# EAGLE schematic spartan6lx_board (EAGLE 5.11)
PROJECT: SPARTAN6-LX9 DEV BOARD
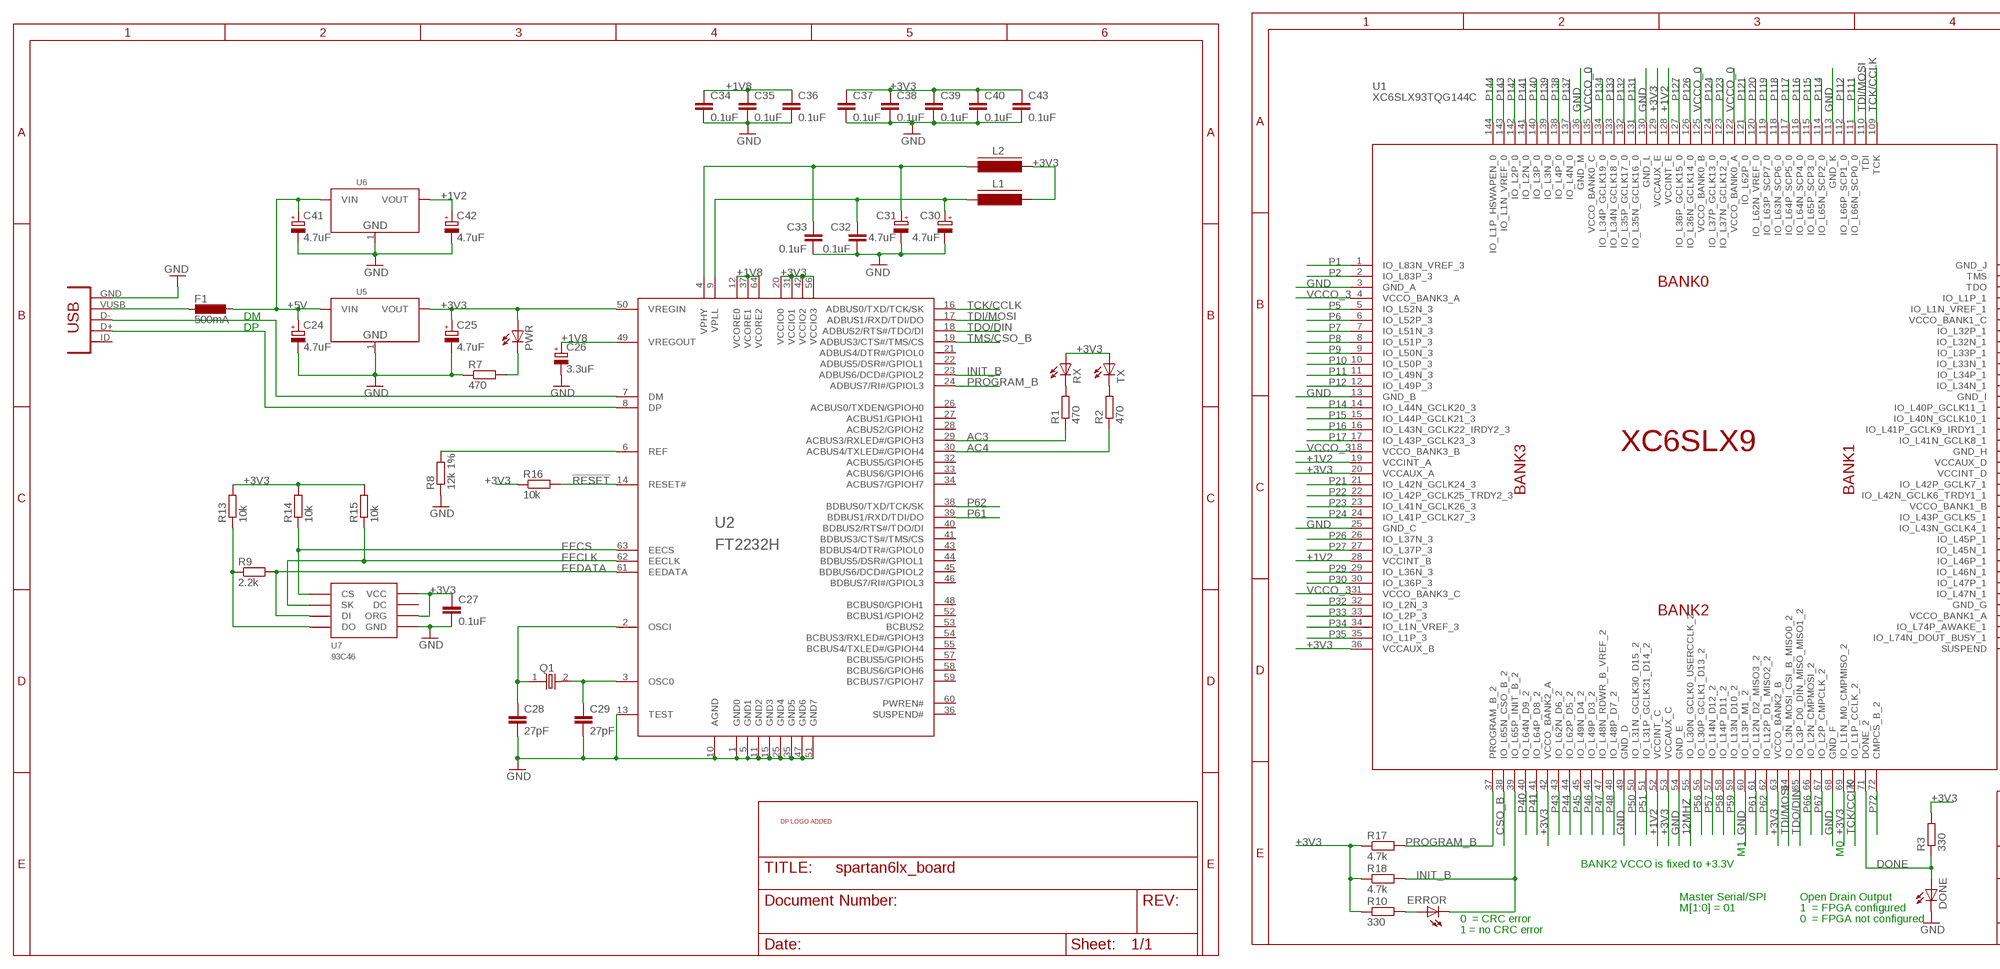
[diagram p0: schematic, sheet 1, part 1 of 2]
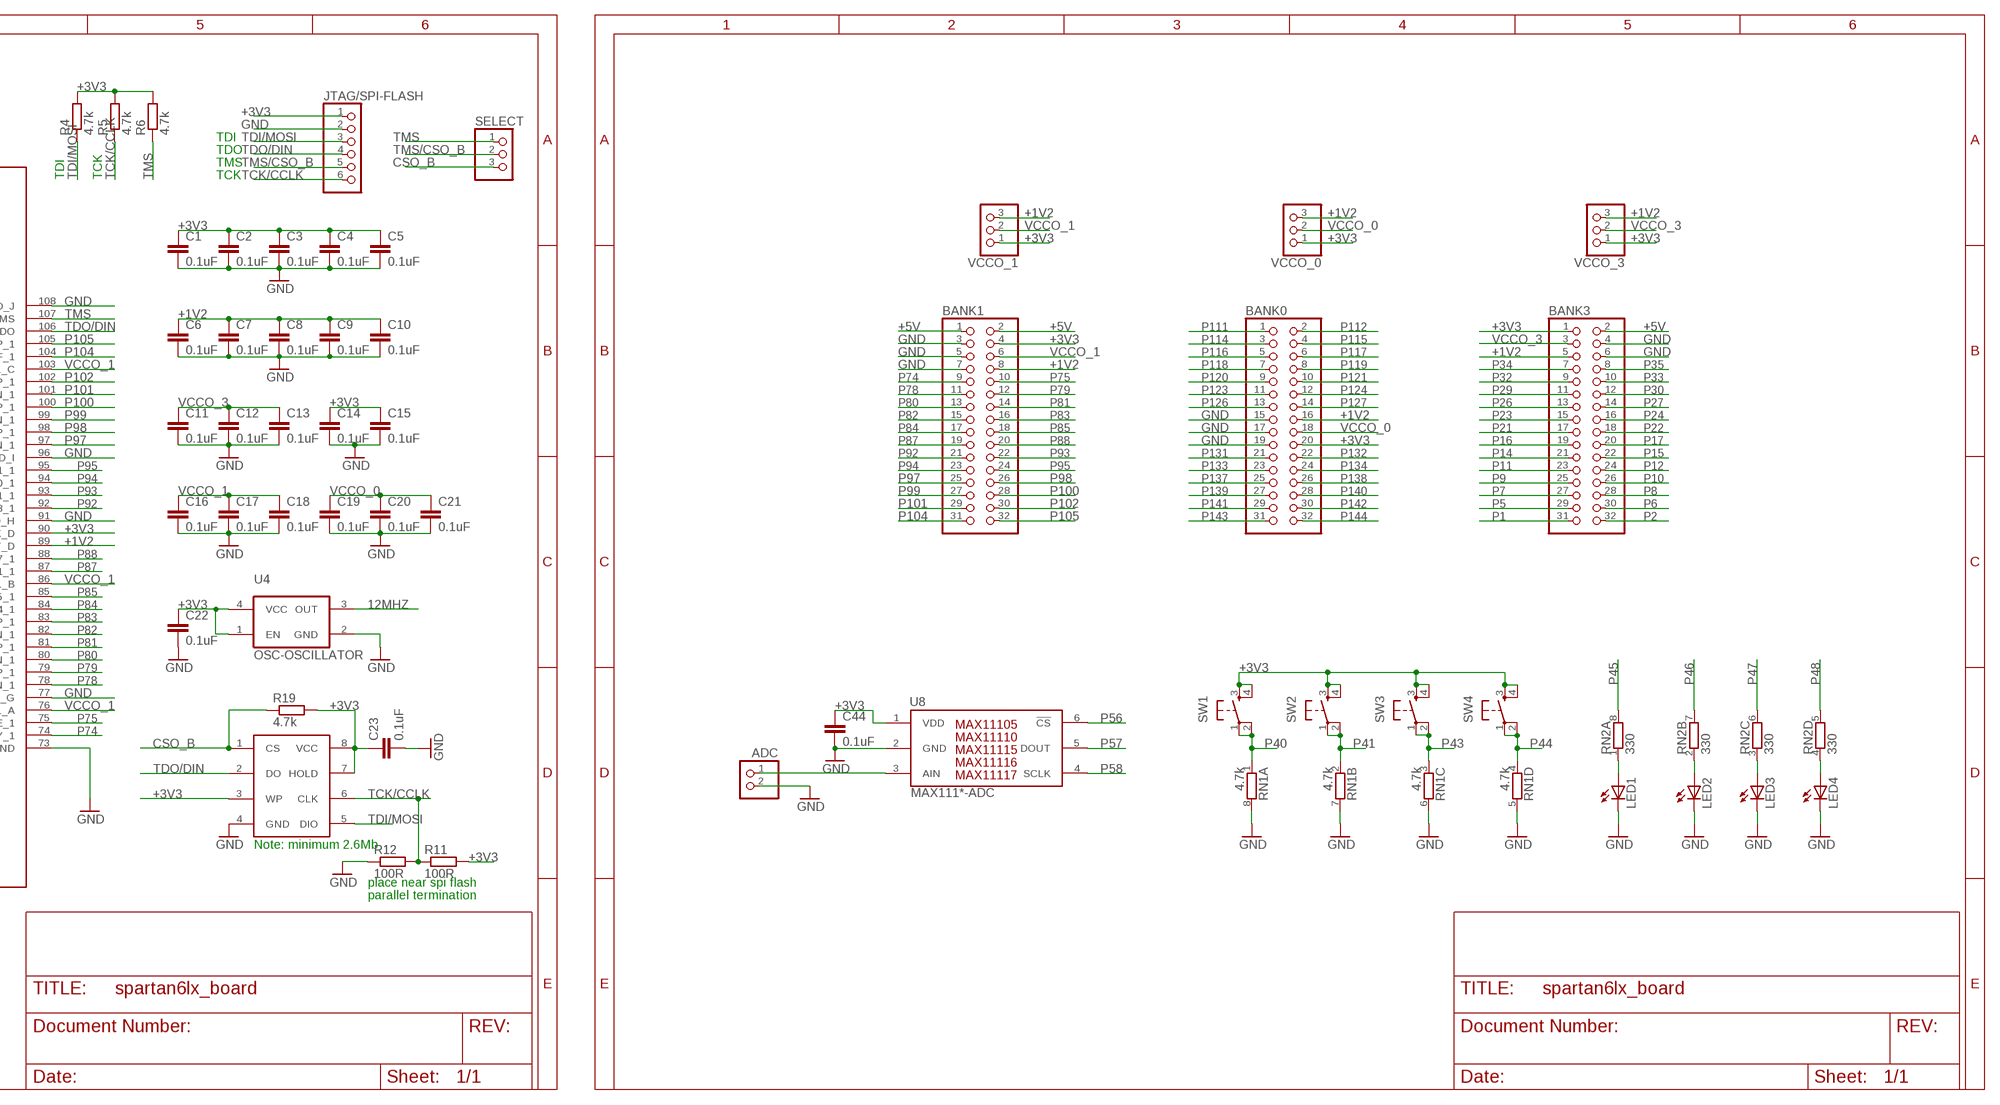
[diagram p1: schematic, sheet 1, part 2 of 2]

## Parts
ADC  PINHD-1X2  [1X02]
BANK0  PINHD-2X16  [2X16]
BANK1  PINHD-2X16  [2X16]
BANK3  PINHD-2X16  [2X16]
C1  0.1uF  CAPC603  [C603]
C2  0.1uF  CAPC603  [C603]
C3  0.1uF  CAPC603  [C603]
C4  0.1uF  CAPC603  [C603]
C5  0.1uF  CAPC603  [C603]
C6  0.1uF  CAPC603  [C603]
C7  0.1uF  CAPC603  [C603]
C8  0.1uF  CAPC603  [C603]
C9  0.1uF  CAPC603  [C603]
C10  0.1uF  CAPC603  [C603]
C11  0.1uF  CAPC603  [C603]
C12  0.1uF  CAPC603  [C603]
C13  0.1uF  CAPC603  [C603]
C14  0.1uF  CAPC603  [C603]
C15  0.1uF  CAPC603  [C603]
C16  0.1uF  CAPC603  [C603]
C17  0.1uF  CAPC603  [C603]
C18  0.1uF  CAPC603  [C603]
C19  0.1uF  CAPC603  [C603]
C20  0.1uF  CAPC603  [C603]
C21  0.1uF  CAPC603  [C603]
C22  0.1uF  CAPC603  [C603]
C23  0.1uF  CAPC603  [C603]
C24  4.7uF  CAP_POLSMC_A  [SMC_A]
C25  4.7uF  CAP_POLSMC_A  [SMC_A]
C26  3.3uF  CAP_POLSMC_A  [SMC_A]
C27  0.1uF  CAPC603  [C603]
C28  27pF  CAPC603  [C603]
C29  27pF  CAPC603  [C603]
C30  4.7uF  CAP_POLSMC_A  [SMC_A]
C31  4.7uF  CAP_POLSMC_A  [SMC_A]
C32  0.1uF  CAPC603  [C603]
C33  0.1uF  CAPC603  [C603]
C34  0.1uF  CAPC603  [C603]
C35  0.1uF  CAPC603  [C603]
C36  0.1uF  CAPC603  [C603]
C37  0.1uF  CAPC603  [C603]
C38  0.1uF  CAPC603  [C603]
C39  0.1uF  CAPC603  [C603]
C40  0.1uF  CAPC603  [C603]
C41  4.7uF  CAP_POLSMC_A  [SMC_A]
C42  4.7uF  CAP_POLSMC_A  [SMC_A]
C43  0.1uF  CAPC603  [C603]
C44  0.1uF  CAPC603  [C603]
DONE  LED805  [LED-805]
ERROR  LED805  [LED-805]
F1  500mA  L-EUL1812  [L1812]
JTAG/SPI-FLASH  PINHD-1X6  [1X06]
L1  FERRITE_BEAD805  [FB805]
L2  FERRITE_BEAD805  [FB805]
LED1  LED805  [LED-805]
LED2  LED805  [LED-805]
LED3  LED805  [LED-805]
LED4  LED805  [LED-805]
PWR  LED805  [LED-805]
Q1  OSC-XTAL  [HC-49U]
R1  470  RESISTORR603  [R603]
R2  470  RESISTORR603  [R603]
R3  330  RESISTORR603  [R603]
R4  4.7k  RESISTORR603  [R603]
R5  4.7k  RESISTORR603  [R603]
R6  4.7k  RESISTORR603  [R603]
R7  470  RESISTORR603  [R603]
R8  12k 1%  RESISTORR603  [R603]
R9  2.2k  RESISTORR603  [R603]
R10  330  RESISTORR603  [R603]
R11  100R  RESISTORR603  [R603]
R12  100R  RESISTORR603  [R603]
R13  10k  RESISTORR603  [R603]
R14  10k  RESISTORR603  [R603]
R15  10k  RESISTORR603  [R603]
R16  10k  RESISTORR603  [R603]
R17  4.7k  RESISTORR603  [R603]
R18  4.7k  RESISTORR603  [R603]
R19  4.7k  RESISTORR603  [R603]
RN1  4.7k  RNETWORK  [RN8P-4R-CRA06S]
RN2  330  RNETWORK  [RN8P-4R-CRA06S]
RX  LED805  [LED-805]
SELECT  PINHD-1X3  [1X03]
SW1  SW-SMD-SMALL  [TACT_SWITCH_SMALL]
SW2  SW-SMD-SMALL  [TACT_SWITCH_SMALL]
SW3  SW-SMD-SMALL  [TACT_SWITCH_SMALL]
SW4  SW-SMD-SMALL  [TACT_SWITCH_SMALL]
TX  LED805  [LED-805]
U1  XC6SLX93TQG144C  [TQFP144]
U2  FT2232H  [LQFP64]
U3  W25X10  [SOIC8W]
U4  OSC-OSCILLATOR  [OSCILLATOR_7X5_SMD]
U5  LD1117-3.3SOT223  [SOT223]
U6  LD1117-3.3SOT223  [SOT223]
U7  93C46  [SOIC8]
U8  MAX111*-ADC  MAX111-ADC  [SOT23-6]
U$1  DP_LOGO  [DP_LOGO]
USB  CON-USB-MINI-BUSB1  [CONN_USB_MINI-B]
VCCO_0  PINHD-1X3  [1X03]
VCCO_1  PINHD-1X3  [1X03]
VCCO_3  PINHD-1X3  [1X03]

## Nets
12MHZ: U1.55(IO_L30N_GCLK0_USERCCLK_2) U4.3(OUT)
!RESET: R16.2 U2.14(RESET#)
+1V2: BANK0.16 BANK1.8 BANK3.5 C6.1 C7.1 C8.1 C9.1 C10.1 C42.+ U1.19(VCCINT_A) U1.28(VCCINT_B) U1.52(VCCINT_C) U1.89(VCCINT_D) U1.128(VCCINT_E) U6.2(VOUT) VCCO_0.3 VCCO_1.3 VCCO_3.3
+1V8: C26.+ C34.1 C35.1 C36.1 U2.12(VCORE0) U2.37(VCORE1) U2.49(VREGOUT) U2.64(VCORE2)
+3V3: BANK0.20 BANK1.4 BANK3.1 C1.1 C2.1 C3.1 C4.1 C5.1 C14.1 C15.1 C22.1 C23.1 C25.+ C27.1 C37.1 C38.1 C39.1 C40.1 C43.1 C44.1 JTAG/SPI-FLASH.1 L1.2 L2.2 PWR.A R3.2 R4.2 R5.2 R6.2 R10.1 R11.2 R13.2 R14.2 R15.2 R16.1 R17.1 R18.1 R19.2 RX.A SW1.3 SW1.4 SW2.3 SW2.4 SW3.3 SW3.4 SW4.3 SW4.4 TX.A U1.20(VCCAUX_A) U1.36(VCCAUX_B) U1.42(VCCO_BANK2_A) U1.53(VCCAUX_C) U1.63(VCCO_BANK2_B) U1.69(IO_L1N_M0_CMPMISO_2) U1.90(VCCAUX_D) U1.129(VCCAUX_E) U2.20(VCCIO0) U2.31(VCCIO1) U2.42(VCCIO2) U2.50(VREGIN) U2.56(VCCIO3) U3.3(WP) U3.7(HOLD) U3.8(VCC) U4.1(EN) U4.4(VCC) U5.2(VOUT) U7.6(ORG) U7.8(VCC) U8.1(VDD) VCCO_0.1 VCCO_1.1 VCCO_3.1
+5V: BANK1.1 BANK1.2 BANK3.2 C24.+ C41.+ F1.1 U5.3(VIN) U6.3(VIN)
AC3: R1.1 U2.29(ACBUS3/RXLED#/GPIOH3)
AC4: R2.1 U2.30(ACBUS4/TXLED#/GPIOH4)
CSO_B: R19.1 SELECT.3 U1.38(IO_L65N_CSO_B_2) U3.1(CS)
DM: U2.7(DM) USB.D-
DONE: DONE.A R3.1 U1.71(DONE_2)
DP: U2.8(DP) USB.D+
EECLK: R15.1 U2.62(EECLK) U7.2(SK)
EECS: R14.1 U2.63(EECS) U7.1(CS)
EEDATA: R9.2 U2.61(EEDATA) U7.3(DI)
GND: ADC.2 BANK0.15 BANK0.17 BANK0.19 BANK1.3 BANK1.5 BANK1.7 BANK3.4 BANK3.6 C1.2 C2.2 C3.2 C4.2 C5.2 C6.2 C7.2 C8.2 C9.2 C10.2 C11.2 C12.2 C13.2 C14.2 C15.2 C16.2 C17.2 C18.2 C19.2 C20.2 C21.2 C22.2 C23.2 C24.- C25.- C26.- C27.2 C28.2 C29.2 C30.- C31.- C32.2 C33.2 C34.2 C35.2 C36.2 C37.2 C38.2 C39.2 C40.2 C41.- C42.- C43.2 C44.2 DONE.C JTAG/SPI-FLASH.2 LED1.C LED2.C LED3.C LED4.C R7.1 R8.1 R12.1 RN1.5 RN1.6 RN1.7 RN1.8 U1.3(GND_A) U1.13(GND_B) U1.25(GND_C) U1.49(GND_D) U1.54(GND_E) U1.60(IO_L13P_M1_2) U1.68(GND_F) U1.73(SUSPEND) U1.77(GND_G) U1.91(GND_H) U1.96(GND_I) U1.108(GND_J) U1.113(GND_K) U1.130(GND_L) U1.136(GND_M) U2.1(GND0) U2.5(GND1) U2.10(AGND) U2.11(GND2) U2.13(TEST) U2.15(GND3) U2.25(GND4) U2.35(GND5) U2.47(GND6) U2.51(GND7) U3.4(GND) U4.2(GND) U5.1(GND) U6.1(GND) U7.5(GND) U8.2(GND) USB.GND
INIT_B: ERROR.C R18.2 U1.39(IO_L65P_INIT_B_2) U2.23(ADBUS6/DCD#/GPIOL2)
N$1: ERROR.A R10.2
N$2: ADC.1 U8.3(AIN)
N$4: LED1.A RN2.1
N$5: LED4.A RN2.4
N$6: LED3.A RN2.3
N$7: LED2.A RN2.2
N$12: R8.2 U2.6(REF)
N$13: C28.1 Q1.1 U2.2(OSCI)
N$14: C29.1 Q1.2 U2.3(OSC0)
N$15: PWR.C R7.2
N$16: R1.2 RX.C
N$17: R2.2 TX.C
N$18: F1.2 USB.VUSB
N$45: R9.1 R13.1 U7.4(DO)
N$48: C31.+ C33.1 L2.1 U2.4(VPHY)
N$49: C30.+ C32.1 L1.1 U2.9(VPLL)
P1: BANK3.31 U1.1(IO_L83N_VREF_3)
P2: BANK3.32 U1.2(IO_L83P_3)
P5: BANK3.29 U1.5(IO_L52N_3)
P6: BANK3.30 U1.6(IO_L52P_3)
P7: BANK3.27 U1.7(IO_L51N_3)
P8: BANK3.28 U1.8(IO_L51P_3)
P9: BANK3.25 U1.9(IO_L50N_3)
P10: BANK3.26 U1.10(IO_L50P_3)
P11: BANK3.23 U1.11(IO_L49N_3)
P12: BANK3.24 U1.12(IO_L49P_3)
P14: BANK3.21 U1.14(IO_L44N_GCLK20_3)
P15: BANK3.22 U1.15(IO_L44P_GCLK21_3)
P16: BANK3.19 U1.16(IO_L43N_GCLK22_IRDY2_3)
P17: BANK3.20 U1.17(IO_L43P_GCLK23_3)
P21: BANK3.17 U1.21(IO_L42N_GCLK24_3)
P22: BANK3.18 U1.22(IO_L42P_GCLK25_TRDY2_3)
P23: BANK3.15 U1.23(IO_L41N_GCLK26_3)
P24: BANK3.16 U1.24(IO_L41P_GCLK27_3)
P26: BANK3.13 U1.26(IO_L37N_3)
P27: BANK3.14 U1.27(IO_L37P_3)
P29: BANK3.11 U1.29(IO_L36N_3)
P30: BANK3.12 U1.30(IO_L36P_3)
P32: BANK3.9 U1.32(IO_L2N_3)
P33: BANK3.10 U1.33(IO_L2P_3)
P34: BANK3.7 U1.34(IO_L1N_VREF_3)
P35: BANK3.8 U1.35(IO_L1P_3)
P40: RN1.1 SW1.1 SW1.2 U1.40(IO_L64N_D9_2)
P41: RN1.2 SW2.1 SW2.2 U1.41(IO_L64P_D8_2)
P43: RN1.3 SW3.1 SW3.2 U1.43(IO_L62N_D6_2)
P44: RN1.4 SW4.1 SW4.2 U1.44(IO_L62P_D5_2)
P45: RN2.8 U1.45(IO_L49N_D4_2)
P46: RN2.7 U1.46(IO_L49P_D3_2)
P47: RN2.6 U1.47(IO_L48N_RDWR_B_VREF_2)
P48: RN2.5 U1.48(IO_L48P_D7_2)
P50: U1.50(IO_L31N_GCLK30_D15_2)
P51: U1.51(IO_L31P_GCLK31_D14_2)
P56: U1.56(IO_L30P_GCLK1_D13_2) U8.6(!CS)
P57: U1.57(IO_L14N_D12_2) U8.5(DOUT)
P58: U1.58(IO_L14P_D11_2) U8.4(SCLK)
P59: U1.59(IO_L13N_D10_2)
P61: U1.61(IO_L12N_D2_MISO3_2) U2.39(BDBUS1/RXD/TDI/DO)
P62: U1.62(IO_L12P_D1_MISO2_2) U2.38(BDBUS0/TXD/TCK/SK)
P66: U1.66(IO_L2N_CMPMOSI_2)
P67: U1.67(IO_L2P_CMPCLK_2)
P72: U1.72(CMPCS_B_2)
P74: BANK1.9 U1.74(IO_L74N_DOUT_BUSY_1)
P75: BANK1.10 U1.75(IO_L74P_AWAKE_1)
P78: BANK1.11 U1.78(IO_L47N_1)
P79: BANK1.12 U1.79(IO_L47P_1)
P80: BANK1.13 U1.80(IO_L46N_1)
P81: BANK1.14 U1.81(IO_L46P_1)
P82: BANK1.15 U1.82(IO_L45N_1)
P83: BANK1.16 U1.83(IO_L45P_1)
P84: BANK1.17 U1.84(IO_L43N_GCLK4_1)
P85: BANK1.18 U1.85(IO_L43P_GCLK5_1)
P87: BANK1.19 U1.87(IO_L42N_GCLK6_TRDY1_1)
P88: BANK1.20 U1.88(IO_L42P_GCLK7_1)
P92: BANK1.21 U1.92(IO_L41N_GCLK8_1)
P93: BANK1.22 U1.93(IO_L41P_GCLK9_IRDY1_1)
P94: BANK1.23 U1.94(IO_L40N_GCLK10_1)
P95: BANK1.24 U1.95(IO_L40P_GCLK11_1)
P97: BANK1.25 U1.97(IO_L34N_1)
P98: BANK1.26 U1.98(IO_L34P_1)
P99: BANK1.27 U1.99(IO_L33N_1)
P100: BANK1.28 U1.100(IO_L33P_1)
P101: BANK1.29 U1.101(IO_L32N_1)
P102: BANK1.30 U1.102(IO_L32P_1)
P104: BANK1.31 U1.104(IO_L1N_VREF_1)
P105: BANK1.32 U1.105(IO_L1P_1)
P111: BANK0.1 U1.111(IO_L66N_SCP0_0)
P112: BANK0.2 U1.112(IO_L66P_SCP1_0)
P114: BANK0.3 U1.114(IO_L65N_SCP2_0)
P115: BANK0.4 U1.115(IO_L65P_SCP3_0)
P116: BANK0.5 U1.116(IO_L64N_SCP4_0)
P117: BANK0.6 U1.117(IO_L64P_SCP5_0)
P118: BANK0.7 U1.118(IO_L63N_SCP6_0)
P119: BANK0.8 U1.119(IO_L63P_SCP7_0)
P120: BANK0.9 U1.120(IO_L62N_VREF_0)
P121: BANK0.10 U1.121(IO_L62P_0)
P123: BANK0.11 U1.123(IO_L37N_GCLK12_0)
P124: BANK0.12 U1.124(IO_L37P_GCLK13_0)
P126: BANK0.13 U1.126(IO_L36N_GCLK14_0)
P127: BANK0.14 U1.127(IO_L36P_GCLK15_0)
P131: BANK0.21 U1.131(IO_L35N_GCLK16_0)
P132: BANK0.22 U1.132(IO_L35P_GCLK17_0)
P133: BANK0.23 U1.133(IO_L34N_GCLK18_0)
P134: BANK0.24 U1.134(IO_L34P_GCLK19_0)
P137: BANK0.25 U1.137(IO_L4N_0)
P138: BANK0.26 U1.138(IO_L4P_0)
P139: BANK0.27 U1.139(IO_L3N_0)
P140: BANK0.28 U1.140(IO_L3P_0)
P141: BANK0.29 U1.141(IO_L2N_0)
P142: BANK0.30 U1.142(IO_L2P_0)
P143: BANK0.31 U1.143(IO_L1N_VREF_0)
P144: BANK0.32 U1.144(IO_L1P_HSWAPEN_0)
PROGRAM_B: R17.2 U1.37(PROGRAM_B_2) U2.24(ADBUS7/RI#/GPIOL3)
TCK/CCLK: JTAG/SPI-FLASH.6 R5.1 R11.1 R12.2 U1.70(IO_L1P_CCLK_2) U1.109(TCK) U2.16(ADBUS0/TXD/TCK/SK) U3.6(CLK)
TDI/MOSI: JTAG/SPI-FLASH.3 R4.1 U1.64(IO_L3N_MOSI_CSI_B_MISO0_2) U1.110(TDI) U2.17(ADBUS1/RXD/TDI/DO) U3.5(DIO)
TDO/DIN: JTAG/SPI-FLASH.4 U1.65(IO_L3P_D0_DIN_MISO_MISO1_2) U1.106(TDO) U2.18(ADBUS2/RTS#/TDO/DI) U3.2(DO)
TMS: R6.1 SELECT.1 U1.107(TMS)
TMS/CSO_B: JTAG/SPI-FLASH.5 SELECT.2 U2.19(ADBUS3/CTS#/TMS/CS)
VCCO_0: BANK0.18 C19.1 C20.1 C21.1 U1.122(VCCO_BANK0_A) U1.125(VCCO_BANK0_B) U1.135(VCCO_BANK0_C) VCCO_0.2
VCCO_1: BANK1.6 C16.1 C17.1 C18.1 U1.76(VCCO_BANK1_A) U1.86(VCCO_BANK1_B) U1.103(VCCO_BANK1_C) VCCO_1.2
VCCO_3: BANK3.3 C11.1 C12.1 C13.1 U1.4(VCCO_BANK3_A) U1.18(VCCO_BANK3_B) U1.31(VCCO_BANK3_C) VCCO_3.2
Unconnected: U2.21(ADBUS4/DTR#/GPIOL0) U2.22(ADBUS5/DSR#/GPIOL1) U2.26(ACBUS0/TXDEN/GPIOH0) U2.27(ACBUS1/GPIOH1) U2.28(ACBUS2/GPIOH2) U2.32(ACBUS5/GPIOH5) U2.33(ACBUS6/GPIOH6) U2.34(ACBUS7/GPIOH7) U2.36(SUSPEND#) U2.40(BDBUS2/RTS#/TDO/DI) U2.41(BDBUS3/CTS#/TMS/CS) U2.43(BDBUS4/DTR#/GPIOL0) U2.44(BDBUS5/DSR#/GPIOL1) U2.45(BDBUS6/DCD#/GPIOL2) U2.46(BDBUS7/RI#/GPIOL3) U2.48(BCBUS0/GPIOH1) U2.52(BCBUS1/GPIOH2) U2.53(BCBUS2) U2.54(BCBUS3/RXLED#/GPIOH3) U2.55(BCBUS4/TXLED#/GPIOH4) U2.57(BCBUS5/GPIOH5) U2.58(BCBUS6/GPIOH6) U2.59(BCBUS7/GPIOH7) U2.60(PWREN#) U7.7(DC) USB.BODY@1(BODY) USB.BODY@2(BODY) USB.BODY@3(BODY) USB.BODY@4(BODY) USB.ID(USBID)

## Notes on the sheet
- TDI
- TDO
- TMS
- TDI | TCK | TCK
- Note: minimum 2.6Mb
- place near spi flash
- parallel termination
- M1 | M0
- BANK2 VCCO is fixed to +3.3V
- Master Serial/SPI | Open Drain Output
- M[1:0] = 01 | 1  = FPGA configured
- 0  = CRC error | 0  = FPGA not configured
- 1 = no CRC error

## Library data of the parts
ADC = pinhead:PINHD-1X2: PIN HEADER
BANK0 BANK1 BANK3 = pinhead:PINHD-2X16: PIN HEADER
C1-C23 C27-C29 C32-C40 C43 C44 = dp_devices:CAP
C24-C26 C30 C31 C41 C42 = dp_devices:CAP_POL
DONE ERROR LED1-LED4 PWR RX TX = dp_devices:LED
F1 = rcl:L-EU: INDUCTOR, European symbol
JTAG/SPI-FLASH = pinhead:PINHD-1X6: PIN HEADER
L1 L2 = dp_devices:FERRITE_BEAD
Q1 = dp_devices:OSC-XTAL
R1-R19 = dp_devices:RESISTOR
RN1 RN2 = dp_devices:RNETWORK: 4 Resistor Array 0603
SELECT VCCO_0 VCCO_1 VCCO_3 = pinhead:PINHD-1X3: PIN HEADER
SW1-SW4 = dp_devices:SW-SMD-SMALL
U1 = dp_devices:XC6SLX9
U2 = DP-EagleLibrary:FT2232H: DUAL HIGH SPEED USB TO MULTIPURPOSE UART/FIFO IC
U3 = dp_devices:W25X10
U4 = dp_devices:OSC-OSCILLATOR: Oscillator
U5 U6 = dp_devices:LD1117-3.3
U7 = dp_devices:93C46; 93C46: 93C46
U8 = dp_devices:MAX111**-ADC
U$1 = dp_devices:DP_LOGO; FF1: fullfillment by; FF2: Seeed studio; FF3: www.seeedstudio.com; LICENSE: CC-BY-SA; PROJECT: project; URL1: http://; URL2: DangerousPrototypes.com
USB = dp_devices:CON-USB-MINI-B: USB connector